# Altium schematic sheet Busswitch.SchDoc
size A4; CompanyName: Technische Hochschule Nürnberg Georg Simon Ohm; Organization: UltraZohm; Address1: Kesslerplatz 12; Address2: 90489 Nürnberg; Address3: GERMANY; DocumentNumber: 12; SheetNumber: 12; SheetTotal: 12; Website: www.ultrazohm.com
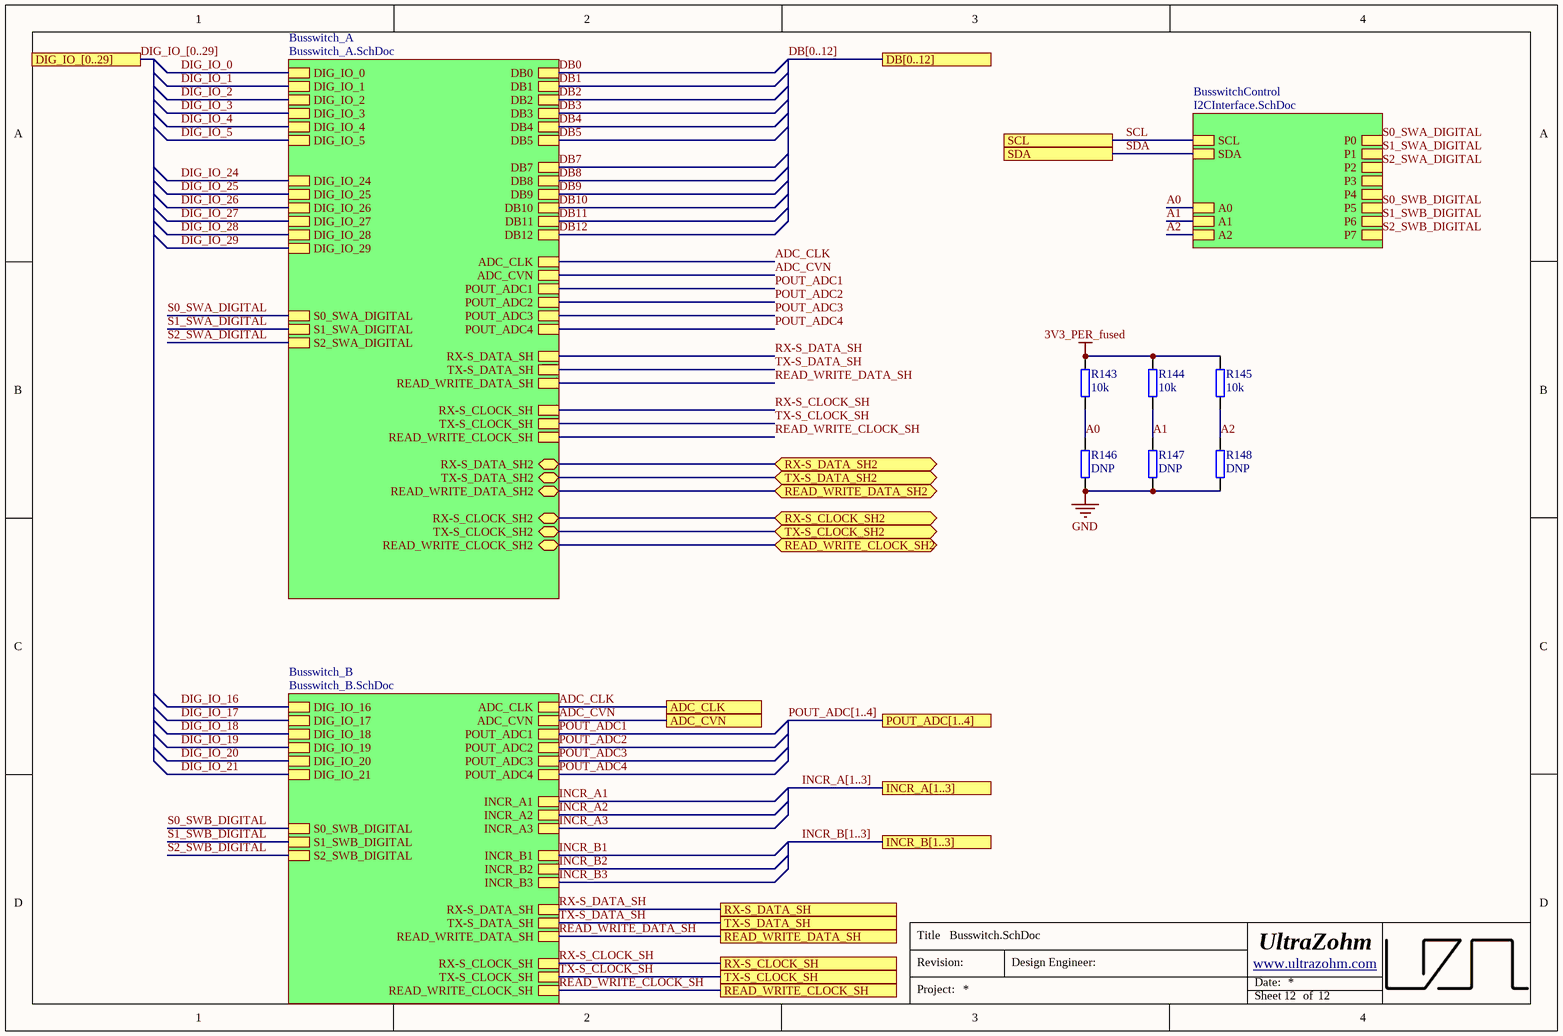
[diagram p0: Busswitch.SchDoc]

## Parts
R143  10k  [RESC1608X06N]
R144  10k  [RESC1608X06N]
R145  10k  [RESC1608X06N]
R146  DNP  [RESC1608X06N]
R147  DNP  [RESC1608X06N]
R148  DNP  [RESC1608X06N]

## Sub-sheets
Busswitch_A = Busswitch_A.SchDoc: DIG_IO_29, DIG_IO_4, DIG_IO_0, DIG_IO_26, DIG_IO_25, DIG_IO_2, DIG_IO_3, DIG_IO_28, DIG_IO_5, DIG_IO_24, DIG_IO_27, DIG_IO_1, DB9, DB12, DB10, DB4, DB8, DB7, DB5, DB11, DB3, DB1, DB2, DB0, POUT_ADC1, ADC_CLK, ADC_CVN, POUT_ADC2, POUT_ADC4, POUT_ADC3, RX-S_DATA_SH, READ_WRITE_CLOCK_SH, TX-S_CLOCK_SH, TX-S_DATA_SH, RX-S_CLOCK_SH, READ_WRITE_DATA_SH, RX-S_DATA_SH2 (bidir), TX-S_DATA_SH2 (bidir), READ_WRITE_CLOCK_SH2 (bidir), TX-S_CLOCK_SH2 (bidir), RX-S_CLOCK_SH2 (bidir), READ_WRITE_DATA_SH2 (bidir), S2_SWA_DIGITAL, S1_SWA_DIGITAL, S0_SWA_DIGITAL
Busswitch_B = Busswitch_B.SchDoc: POUT_ADC4, INCR_A1, READ_WRITE_DATA_SH, INCR_B1, POUT_ADC1, POUT_ADC2, INCR_A3, INCR_A2, TX-S_CLOCK_SH, READ_WRITE_CLOCK_SH, RX-S_CLOCK_SH, INCR_B3, POUT_ADC3, ADC_CLK, INCR_B2, ADC_CVN, TX-S_DATA_SH, RX-S_DATA_SH, DIG_IO_18, DIG_IO_21, DIG_IO_20, DIG_IO_19, DIG_IO_16, DIG_IO_17, S2_SWB_DIGITAL, S1_SWB_DIGITAL, S0_SWB_DIGITAL
BusswitchControl = I2CInterface.SchDoc: P4, P7, SDA, P2, P1, A1, A2, P3, P6, SCL, A0, P0, P5

## Ports
ADC_CLK, ADC_CVN, DB[0..12], DIG_IO_[0..29], INCR_A[1..3], INCR_B[1..3], POUT_ADC[1..4], READ_WRITE_CLOCK_SH, READ_WRITE_CLOCK_SH2 (bidir), READ_WRITE_DATA_SH, READ_WRITE_DATA_SH2 (bidir), RX-S_CLOCK_SH, RX-S_CLOCK_SH2 (bidir), RX-S_DATA_SH, RX-S_DATA_SH2 (bidir), SCL, SDA, TX-S_CLOCK_SH, TX-S_CLOCK_SH2 (bidir), TX-S_DATA_SH, TX-S_DATA_SH2 (bidir)

## Nets
3V3_PER_fused: R143.1 R144.1 R145.1
GND: R146.2 R147.2 R148.2
A0: R143.2 R146.1 ; sheet BusswitchControl/A0
A1: R144.2 R147.1 ; sheet BusswitchControl/A1
A2: R145.2 R148.1 ; sheet BusswitchControl/A2
ADC_CLK: port ADC_CLK, sheet Busswitch_B/ADC_CLK, sheet Busswitch_A/ADC_CLK
ADC_CVN: port ADC_CVN, sheet Busswitch_B/ADC_CVN, sheet Busswitch_A/ADC_CVN
DB0: sheet Busswitch_A/DB0
DB1: sheet Busswitch_A/DB1
DB2: sheet Busswitch_A/DB2
DB3: sheet Busswitch_A/DB3
DB4: sheet Busswitch_A/DB4
DB5: sheet Busswitch_A/DB5
DB7: sheet Busswitch_A/DB7
DB8: sheet Busswitch_A/DB8
DB9: sheet Busswitch_A/DB9
DB10: sheet Busswitch_A/DB10
DB11: sheet Busswitch_A/DB11
DB12: sheet Busswitch_A/DB12
DIG_IO_0: sheet Busswitch_A/DIG_IO_0
DIG_IO_1: sheet Busswitch_A/DIG_IO_1
DIG_IO_2: sheet Busswitch_A/DIG_IO_2
DIG_IO_3: sheet Busswitch_A/DIG_IO_3
DIG_IO_4: sheet Busswitch_A/DIG_IO_4
DIG_IO_5: sheet Busswitch_A/DIG_IO_5
DIG_IO_16: sheet Busswitch_B/DIG_IO_16
DIG_IO_17: sheet Busswitch_B/DIG_IO_17
DIG_IO_18: sheet Busswitch_B/DIG_IO_18
DIG_IO_19: sheet Busswitch_B/DIG_IO_19
DIG_IO_20: sheet Busswitch_B/DIG_IO_20
DIG_IO_21: sheet Busswitch_B/DIG_IO_21
DIG_IO_24: sheet Busswitch_A/DIG_IO_24
DIG_IO_25: sheet Busswitch_A/DIG_IO_25
DIG_IO_26: sheet Busswitch_A/DIG_IO_26
DIG_IO_27: sheet Busswitch_A/DIG_IO_27
DIG_IO_28: sheet Busswitch_A/DIG_IO_28
DIG_IO_29: sheet Busswitch_A/DIG_IO_29
INCR_A1: sheet Busswitch_B/INCR_A1
INCR_A2: sheet Busswitch_B/INCR_A2
INCR_A3: sheet Busswitch_B/INCR_A3
INCR_B1: sheet Busswitch_B/INCR_B1
INCR_B2: sheet Busswitch_B/INCR_B2
INCR_B3: sheet Busswitch_B/INCR_B3
POUT_ADC1: sheet Busswitch_B/POUT_ADC1, sheet Busswitch_A/POUT_ADC1
POUT_ADC2: sheet Busswitch_B/POUT_ADC2, sheet Busswitch_A/POUT_ADC2
POUT_ADC3: sheet Busswitch_B/POUT_ADC3, sheet Busswitch_A/POUT_ADC3
POUT_ADC4: sheet Busswitch_B/POUT_ADC4, sheet Busswitch_A/POUT_ADC4
READ_WRITE_CLOCK_SH: port READ_WRITE_CLOCK_SH, sheet Busswitch_B/READ_WRITE_CLOCK_SH, sheet Busswitch_A/READ_WRITE_CLOCK_SH
READ_WRITE_CLOCK_SH2: port READ_WRITE_CLOCK_SH2, sheet Busswitch_A/READ_WRITE_CLOCK_SH2
READ_WRITE_DATA_SH: port READ_WRITE_DATA_SH, sheet Busswitch_B/READ_WRITE_DATA_SH, sheet Busswitch_A/READ_WRITE_DATA_SH
READ_WRITE_DATA_SH2: port READ_WRITE_DATA_SH2, sheet Busswitch_A/READ_WRITE_DATA_SH2
RX-S_CLOCK_SH: port RX-S_CLOCK_SH, sheet Busswitch_B/RX-S_CLOCK_SH, sheet Busswitch_A/RX-S_CLOCK_SH
RX-S_CLOCK_SH2: port RX-S_CLOCK_SH2, sheet Busswitch_A/RX-S_CLOCK_SH2
RX-S_DATA_SH: port RX-S_DATA_SH, sheet Busswitch_B/RX-S_DATA_SH, sheet Busswitch_A/RX-S_DATA_SH
RX-S_DATA_SH2: port RX-S_DATA_SH2, sheet Busswitch_A/RX-S_DATA_SH2
S0_SWA_DIGITAL: sheet Busswitch_A/S0_SWA_DIGITAL, sheet BusswitchControl/P0
S0_SWB_DIGITAL: sheet Busswitch_B/S0_SWB_DIGITAL, sheet BusswitchControl/P5
S1_SWA_DIGITAL: sheet Busswitch_A/S1_SWA_DIGITAL, sheet BusswitchControl/P1
S1_SWB_DIGITAL: sheet Busswitch_B/S1_SWB_DIGITAL, sheet BusswitchControl/P6
S2_SWA_DIGITAL: sheet Busswitch_A/S2_SWA_DIGITAL, sheet BusswitchControl/P2
S2_SWB_DIGITAL: sheet Busswitch_B/S2_SWB_DIGITAL, sheet BusswitchControl/P7
SCL: port SCL, sheet BusswitchControl/SCL
SDA: port SDA, sheet BusswitchControl/SDA
TX-S_CLOCK_SH: port TX-S_CLOCK_SH, sheet Busswitch_B/TX-S_CLOCK_SH, sheet Busswitch_A/TX-S_CLOCK_SH
TX-S_CLOCK_SH2: port TX-S_CLOCK_SH2, sheet Busswitch_A/TX-S_CLOCK_SH2
TX-S_DATA_SH: port TX-S_DATA_SH, sheet Busswitch_B/TX-S_DATA_SH, sheet Busswitch_A/TX-S_DATA_SH
TX-S_DATA_SH2: port TX-S_DATA_SH2, sheet Busswitch_A/TX-S_DATA_SH2

## Buses and harness runs
bus DB[0..12] = port DB[0..12]
bus DIG_IO_[0..29] = port DIG_IO_[0..29]
bus INCR_A[1..3] = port INCR_A[1..3]
bus INCR_B[1..3] = port INCR_B[1..3]
bus POUT_ADC[1..4] = port POUT_ADC[1..4]

## Notes on the sheet
- Title
- Revision:
- Design Engineer:
- Date:
- Project:
- Sheet
- of

## Library data of the parts
R143-R148 = R_0603: MPN: CRCW06030000Z0EAC; MF: Vishay; Supplier 1: Mouser; Supplier Part Number 1: 71-CRCW06030000Z0EAC
  R143-R145: Value: 10k
  R146-R148: Value: DNP